# Altium project ScaleSimulator_Test.PrjPcb
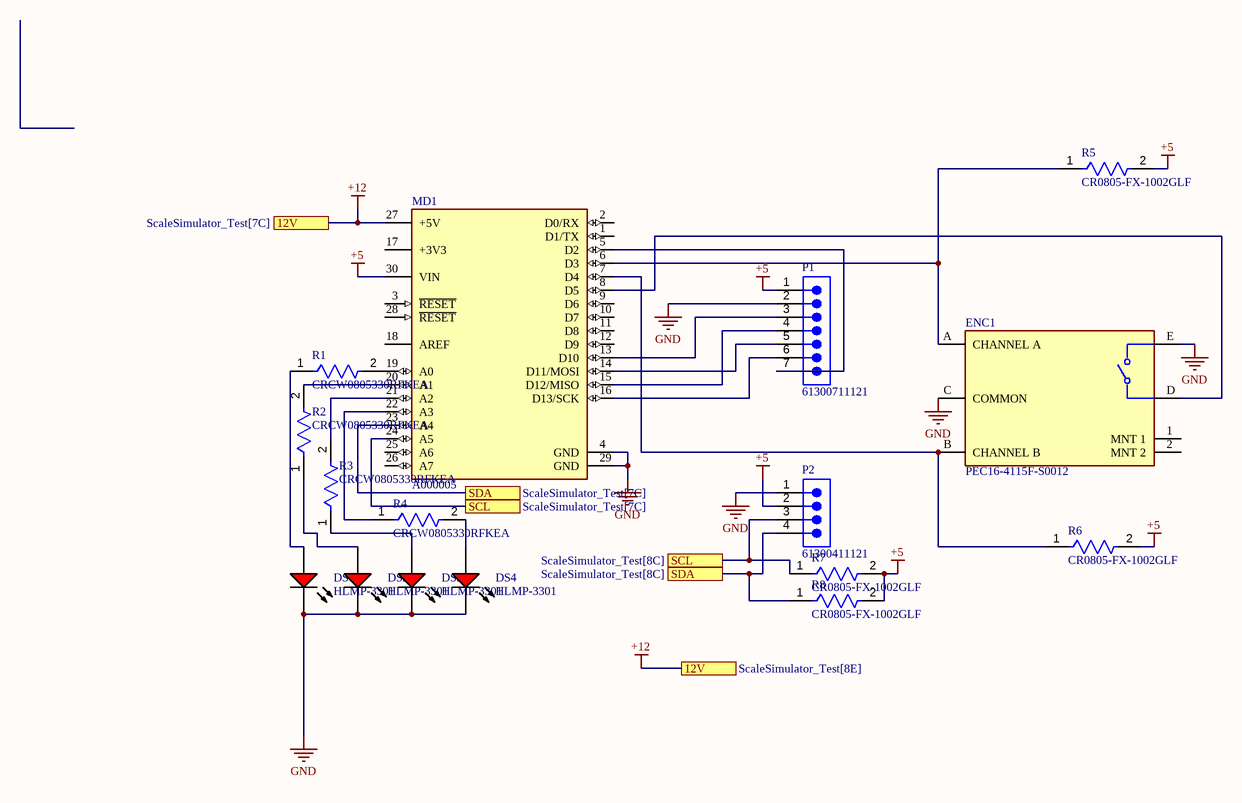
[diagram p0: ScaleSimulator_Test.SchDoc]
1 sheet, 16 parts. Net scope: flat (ports and power ports of the same name join across sheets).
Board file: ScaleSimulator_Test.PcbDoc

## Sheet ScaleSimulator_Test.SchDoc: Frequency Divider Tester
size 431 x 279 mm; Organization: SurePoint Ag Systems; Address1: 9904 Hwy 25; Address2: Atwood KS 67730; DocumentNumber: 1; Revision: A1; SheetNumber: 1; SheetTotal: 1

### Parts
DS1  HLMP-3301  [AVAG-HLMP-3301-2]
DS2  HLMP-3301  [AVAG-HLMP-3301-2]
DS3  HLMP-3301  [AVAG-HLMP-3301-2]
DS4  HLMP-3301  [AVAG-HLMP-3301-2]
ENC1  PEC16-4115F-S0012  [FP-PEC16-4115F-S0012-MFG]
MD1  A000005  [FP-A000005-MFG]
P1  61300711121  [61300711121]
P2  61300411121  [61300411121]
R1  CRCW0805330RFKEA  [FP-CRCW0805-e3-MFG]
R2  CRCW0805330RFKEA  [FP-CRCW0805-e3-MFG]
R3  CRCW0805330RFKEA  [FP-CRCW0805-e3-MFG]
R4  CRCW0805330RFKEA  [FP-CRCW0805-e3-MFG]
R5  CR0805-FX-1002GLF  [FP-CR0805-IPC_C]
R6  CR0805-FX-1002GLF  [FP-CR0805-IPC_C]
R7  CR0805-FX-1002GLF  [FP-CR0805-IPC_C]
R8  CR0805-FX-1002GLF  [FP-CR0805-IPC_C]

### Ports
12V (see ScaleSimulator_Test[7C]), 12V (see ScaleSimulator_Test[8E]), SCL (see ScaleSimulator_Test[7C]), SCL (see ScaleSimulator_Test[8C]), SDA (see ScaleSimulator_Test[7C]), SDA (see ScaleSimulator_Test[8C])

### Nets
+5: MD1.30(VIN) P1.1 P2.2 R5.2 R6.2 R7.2 R8.2
+12: MD1.27(+5V) ; port 12V
GND: DS1.1(K) DS2.1(K) DS3.1(K) DS4.1(K) ENC1.C(COMMON) ENC1.E MD1.4(GND) MD1.29(GND) P1.2 P2.1
NetDS1_2: DS1.2(A) R1.1
NetDS2_2: DS2.2(A) R2.1
NetDS3_2: DS3.2(A) R3.1
NetDS4_2: DS4.2(A) R4.2
NetENC1_A: ENC1.A(CHANNEL_A) MD1.6(D3) R5.1
NetENC1_B: ENC1.B(CHANNEL_B) MD1.7(D4) R6.1
NetENC1_D: ENC1.D MD1.8(D5)
NetMD1_5: MD1.5(D2) P1.7
NetMD1_13: MD1.13(D10) P1.3
NetMD1_14: MD1.14(D11/MOSI) P1.5
NetMD1_15: MD1.15(D12/MISO) P1.4
NetMD1_16: MD1.16(D13/SCK) P1.6
NetMD1_19: MD1.19(A0) R1.2
NetMD1_20: MD1.20(A1) R2.2
NetMD1_21: MD1.21(A2) R3.2
NetMD1_22: MD1.22(A3) R4.1
NetMD1_23: MD1.23(A4) P2.4 R8.1 ; port SDA
NetMD1_24: MD1.24(A5) P2.3 R7.1 ; port SCL

Not connected (* = marked no-connect by the designer): ENC1 1(MNT_1) 2(MNT_2); MD1 1(D1/TX) 2(D0/RX) 3(~{RESET}) 9(D6) 10(D7) 11(D8) 12(D9) 17(+3V3) 18(AREF) 25(A6) 26(A7) 28(~{RESET})

### Library data of the parts
DS1-DS4 = CMP-2000-06411-1: T-1 3/4 (5 mm) Diffused LED Lamp, 1.9 V, -40 to 100 degC, 2-Pin THD, RoHS, Bulk; Manufacturer: Avago; Forward Current: 25mA; Forward Voltage: 2.4V; Peak Wavelength: 635nm; Shape Type: Circular; High Brightness: No; Main Category: StandardLED; Test Current (It): 10mA; Dominant Wave Length: 626nm; Number of  Elements: 1; Reverse Voltage: 5V; Chip Material: GaP; Product Height (mm): 9.19mm; Lens Type: ColoredDiffused; Viewing Angle: 60deg; Type: Uni-Color; Emitting Color: Red; Luminous Intensity: 5.4mcd; Power Dissipation: 85W; DELETED: Compliant; Product Depth (mm): 6.1mm; Package Description: 2-Pin Through Hole LED, Dia 5.85 mm; Mounting Technology: ThroughHole; Manufacturer URL: http://www.avagotech.com/; Package Type: T-13/4; Operating Temp Range: -40Cto100C; Datasheet URL: http://www.avagotech.com/docs/AV02-1558EN; Mounting: ThroughHole; Lens Dimensions: 5.08x5.08x8.3mm; Package Reference: HLMP-3301; Datasheet Version: 03/2015; Pin Count: 2; Packaging: TapeandReel; Operating Temperature Classification: Industrial; Lum Intensity: 5.4mcd; Rad Hardened: No; Product Length (mm): 6.1mm
ENC1 = CMP-07421-000056-1: ROTARY ENCODER MECHANICAL 12PPR; Pulses per Revolution: 12; Built in Switch: Yes; Output Type: Quadrature; Number of Channels: 2; Operating Supply Voltage: 5V; Min Operating Temperature: -30°C; Package Quantity: 50; Length: 23mm; Height: 17.3mm; Mount: Through Hole; Termination: PC Pin; Encoder Type: Mechanical; Max Operating Temperature: 70°C; Orientation: Vertical; RoHS Compliant: Yes; Series: PEC16; Width: 16mm; Detent: Yes
MD1 = CMP-189986-000002-1: ARDUINO NANO ATMEGA328 EVAL BRD; Number of Bits: 8; Evaluation Kit: Yes; Operating Supply Voltage: 12V; Interface: I2C; Data Bus Width: 8b; Core Architecture: AVR; Packaging: Bulk; Length: 7inch; Package Quantity: 50; Width: 5inch; REACH SVHC: No SVHC; Weight: 0.358383oz; Series: AVR® ATmega; Height: 0.25inch
P1 = CMP-1502-01074-3: NexarPartId: 32855531; Current Rating: 3A; Number of Positions: 7; Connector Type: Male Pin; Gender: Male; Operating Supply Voltage: 250V; Pitch: 2.54mm; Contact Resistance: 20mΩ; Contact Material: Copper; Contact Plating: Gold; Contact Mating Length: 5.9944mm; Mount: Through Hole; Termination: Solder; Number of Pins: 7; Color: Black; Packaging: Bulk; REACH SVHC: Unknown; Orientation: Vertical; Lead Pitch: 2.54mm; RoHS: Compliant; Number of Rows: 1; Number of Contacts: 7
P2 = CMP-1502-01064-3: NexarPartId: 32855522; Operating Supply Voltage: 250V; Pitch: 2.54mm; Contact Resistance: 20mΩ; Number of Positions: 4; Current Rating: 3A; Connector Type: Male Pin; Gender: Male; Contact Plating: Gold; Height: 8.89mm; Lead Pitch: 2.54mm; Lead Free: Lead Free; Contact Mating Length: 5.9944mm; Number of Rows: 1; Termination: Solder; Packaging: Bulk; REACH SVHC: Unknown; Min Operating Temperature: -40°C; RoHS: Compliant; Number of Contacts: 4; Voltage Rating: 250V; Color: Black; Max Operating Temperature: 105°C; Contact Material: Copper; Mount: Through Hole; Orientation: Vertical; Number of Pins: 4
R1-R4 = CMP-2001-03823-2: RES Thick Film, 330Ω, 1%, 0.125W, 100ppm/°C, 0805; Voltage Rating (DC): 150V; Resistance: 330R; Max Power Dissipation: 125mW; Mount: Surface Mount; Packaging: Tape and Reel; Min Operating Temperature: -55°C; Military Standard: Not; Case Code (Metric): 2012; Height: 0.02inch; Voltage Rating: 150V; Case/Package: 0805; Max Operating Temperature: 155°C; Width: 0.049inch; Case Code (Imperial): 0805; Termination: SMD/SMT; Lead Free: Lead Free; Contact Plating: Tin; Package Quantity: 10; Composition: Thick Film; Length: 2mm; Features: Automotive AEC-Q200; Depth: 1.25mm; Weight: 0.000194oz; Tolerance: 1%; Power Rating: 125mW; Number of Terminations: 2; Temperature Coefficient: 100ppm/°C
R5-R8 = CMP-07231-006769-1: Thick Film Chip Resistors 0805 10kΩ 0.125W 1% 100ppm/°C; Voltage Rating: 150V; Power Rating: 125mW; Resistance: 10kR; Case/Package: 0805; Height: 0.024inch; Thickness: 508um; REACH SVHC: No SVHC; Voltage Rating (DC): 150V; Construction: Rectangular; Number of Pins: 2; Case Code (Metric): 2012; Case Code (Imperial): 0805; Max Operating Temperature: 155°C; Military Standard: Not; Packaging: Tape and Reel; Resistor Type: Thick Film; Temperature Coefficient: 100ppm/°C; Contact Plating: Tin; Depth: 1.25mm; Features: Moisture Resistant; Width: 0.049inch; Mount: Surface Mount; Max Power Dissipation: 125mW; Length: 2mm; Number of Terminations: 2; Resistance Tolerance: 1%; Termination: SMD/SMT; Min Operating Temperature: -55°C; Tolerance: 1%; Technology: THICK FILM; Series: CR0805; Radiation Hardening: No